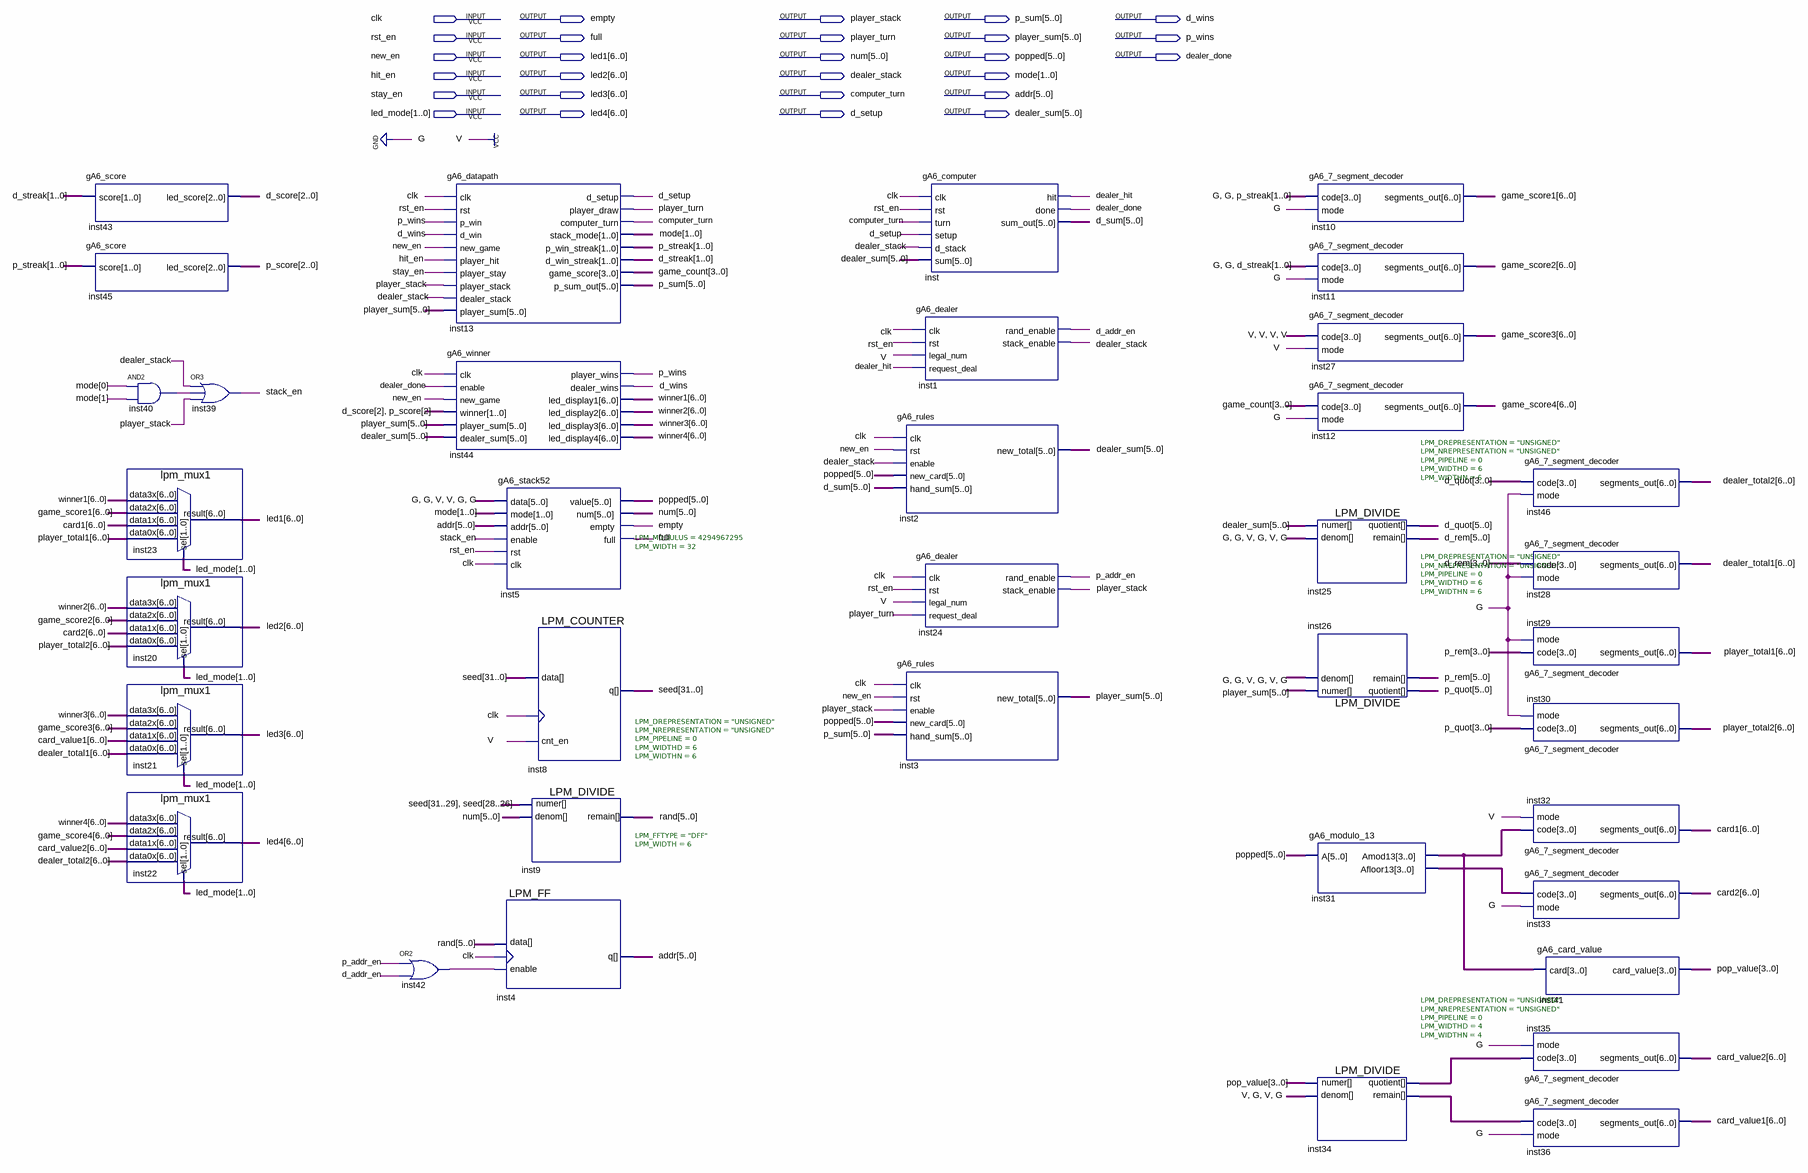
[diagram p0: schematic sheet]
// Quartus schematic gA6_block_blackjack.bdf as structural Verilog: 37 symbols, 27 pins
module gA6_block_blackjack (
  input  clk,
  input  rst_en,
  input  new_en,
  input  hit_en,
  input  stay_en,
  input  [1:0] led_mode,
  output empty,
  output player_stack,
  output [5:0] p_sum,
  output d_wins,
  output full,
  output player_turn,
  output [5:0] player_sum,
  output p_wins,
  output [6:0] led1,
  output [5:0] num,
  output [5:0] popped,
  output dealer_done,
  output [6:0] led2,
  output dealer_stack,
  output [1:0] mode,
  output [6:0] led3,
  output computer_turn,
  output [5:0] addr,
  output [6:0] led4,
  output d_setup,
  output [5:0] dealer_sum
);

  wire d_addr_en, dealer_hit, inst40_out, inst42_out, p_addr_en, stack_en;
  wire [1:0] d_streak, p_streak;
  wire [2:0] d_score, p_score;
  wire [3:0] game_count, inst31_afloor13, inst31_amod13, inst34_quotient, inst34_remain, pop_value;
  wire [5:0] d_quot, d_rem, d_sum, p_quot, p_rem, \rand ;
  wire [6:0] card1, card2, card_value1, card_value2, dealer_total1, dealer_total2, game_score1, game_score2,
       game_score3, game_score4, player_total1, player_total2, winner1, winner2, winner3, winner4;
  wire [31:0] seed;

  gA6_score inst43 (.score(d_streak), .led_score(d_score));
  gA6_score inst45 (.score(p_streak), .led_score(p_score));
  and inst40 (inst40_out, mode[0], mode[1]);
  lpm_mux1 inst23 (
    .data3x(winner1), .data2x(game_score1), .data1x(card1), .data0x(player_total1), .sel(led_mode),
    .result(led1));
  lpm_mux1 inst20 (
    .data3x(winner2), .data2x(game_score2), .data1x(card2), .data0x(player_total2), .sel(led_mode),
    .result(led2));
  lpm_mux1 inst21 (
    .data3x(winner3), .data2x(game_score3), .data1x(card_value1), .data0x(dealer_total1), .sel(led_mode),
    .result(led3));
  lpm_mux1 inst22 (
    .data3x(winner4), .data2x(game_score4), .data1x(card_value2), .data0x(dealer_total2), .sel(led_mode),
    .result(led4));
  or inst39 (stack_en, dealer_stack, inst40_out, player_stack);
  or inst42 (inst42_out, p_addr_en, d_addr_en);
  gA6_datapath inst13 (
    .clk(clk), .rst(rst_en), .p_win(p_wins), .d_win(d_wins), .new_game(new_en), .player_hit(hit_en),
    .player_stay(stay_en), .player_stack(player_stack), .dealer_stack(dealer_stack), .player_sum(player_sum),
    .d_setup(d_setup), .player_draw(player_turn), .computer_turn(computer_turn), .stack_mode(mode),
    .p_win_streak(p_streak), .d_win_streak(d_streak), .game_score(game_count), .p_sum_out(p_sum));
  gA6_winner inst44 (
    .clk(clk), .enable(dealer_done), .new_game(new_en), .winner({d_score[2], p_score[2]}),
    .player_sum(player_sum), .dealer_sum(dealer_sum), .player_wins(p_wins), .dealer_wins(d_wins),
    .led_display1(winner1), .led_display2(winner2), .led_display3(winner3), .led_display4(winner4));
  gA6_stack52 inst5 (
    .data(6'b001100), .mode(mode), .addr(addr), .enable(stack_en), .rst(rst_en), .clk(clk), .value(popped),
    .num(num), .empty(empty), .full(full));
  LPM_DIVIDE #(.LPM_DREPRESENTATION("UNSIGNED"), .LPM_NREPRESENTATION("UNSIGNED"), .LPM_PIPELINE(0), .LPM_WIDTHD(6), .LPM_WIDTHN(6)) inst9 (
    .numer(seed[31:26]), .denom(num), .remain(\rand ));
  LPM_FF #(.LPM_FFTYPE("DFF"), .LPM_WIDTH(6)) inst4 (.enable(inst42_out), .clock(clk), .data(\rand ), .q(addr));
  LPM_COUNTER #(.LPM_MODULUS(4294967295), .LPM_WIDTH(32)) inst8 (.clock(clk), .cnt_en(1'b1), .data(seed), .q(seed));
  gA6_computer inst (
    .clk(clk), .rst(rst_en), .turn(computer_turn), .setup(d_setup), .d_stack(dealer_stack), .sum(dealer_sum),
    .hit(dealer_hit), .done(dealer_done), .sum_out(d_sum));
  gA6_dealer inst1 (
    .clk(clk), .rst(rst_en), .legal_num(1'b1), .request_deal(dealer_hit), .rand_enable(d_addr_en),
    .stack_enable(dealer_stack));
  gA6_rules inst2 (
    .clk(clk), .rst(new_en), .enable(dealer_stack), .new_card(popped), .hand_sum(d_sum),
    .new_total(dealer_sum));
  gA6_dealer inst24 (
    .clk(clk), .rst(rst_en), .legal_num(1'b1), .request_deal(player_turn), .rand_enable(p_addr_en),
    .stack_enable(player_stack));
  gA6_rules inst3 (
    .clk(clk), .rst(new_en), .enable(player_stack), .new_card(popped), .hand_sum(p_sum),
    .new_total(player_sum));
  gA6_7_segment_decoder inst10 (.code({2'b00, p_streak}), .mode(1'b0), .segments_out(game_score1));
  gA6_7_segment_decoder inst11 (.code({2'b00, d_streak}), .mode(1'b0), .segments_out(game_score2));
  gA6_7_segment_decoder inst27 (.code(4'b1111), .mode(1'b1), .segments_out(game_score3));
  gA6_7_segment_decoder inst12 (.code(game_count), .mode(1'b0), .segments_out(game_score4));
  LPM_DIVIDE #(.LPM_DREPRESENTATION("UNSIGNED"), .LPM_NREPRESENTATION("UNSIGNED"), .LPM_PIPELINE(0), .LPM_WIDTHD(6), .LPM_WIDTHN(6)) inst25 (
    .numer(dealer_sum), .denom(6'b001010), .quotient(d_quot), .remain(d_rem));
  LPM_DIVIDE #(.LPM_DREPRESENTATION("UNSIGNED"), .LPM_NREPRESENTATION("UNSIGNED"), .LPM_PIPELINE(0), .LPM_WIDTHD(6), .LPM_WIDTHN(6)) inst26 (
    .numer(player_sum), .denom(6'b001010), .quotient(p_quot), .remain(p_rem));
  gA6_modulo_13 inst31 (.A(popped), .Amod13(inst31_amod13), .Afloor13(inst31_afloor13));
  LPM_DIVIDE #(.LPM_DREPRESENTATION("UNSIGNED"), .LPM_NREPRESENTATION("UNSIGNED"), .LPM_PIPELINE(0), .LPM_WIDTHD(4), .LPM_WIDTHN(4)) inst34 (
    .numer(pop_value), .denom(4'b1010), .quotient(inst34_quotient), .remain(inst34_remain));
  gA6_7_segment_decoder inst46 (.code(d_quot[3:0]), .mode(1'b0), .segments_out(dealer_total2));
  gA6_7_segment_decoder inst28 (.code(d_rem[3:0]), .mode(1'b0), .segments_out(dealer_total1));
  gA6_7_segment_decoder inst29 (.code(p_rem[3:0]), .mode(1'b0), .segments_out(player_total1));
  gA6_7_segment_decoder inst30 (.code(p_quot[3:0]), .mode(1'b0), .segments_out(player_total2));
  gA6_7_segment_decoder inst32 (.code(inst31_amod13), .mode(1'b1), .segments_out(card1));
  gA6_7_segment_decoder inst33 (.code(inst31_afloor13), .mode(1'b0), .segments_out(card2));
  gA6_card_value inst41 (.card(inst31_amod13), .card_value(pop_value));
  gA6_7_segment_decoder inst35 (.code(inst34_quotient), .mode(1'b0), .segments_out(card_value2));
  gA6_7_segment_decoder inst36 (.code(inst34_remain), .mode(1'b0), .segments_out(card_value1));
endmodule
